# Altium schematic sheet Hierarchal-Power.SchDoc: Hierarchal Power
size 279 x 215 mm; DrawnBy: Ethan Abraham; Engineer: Ethan Abraham; SheetNumber: 2; SheetTotal: 7
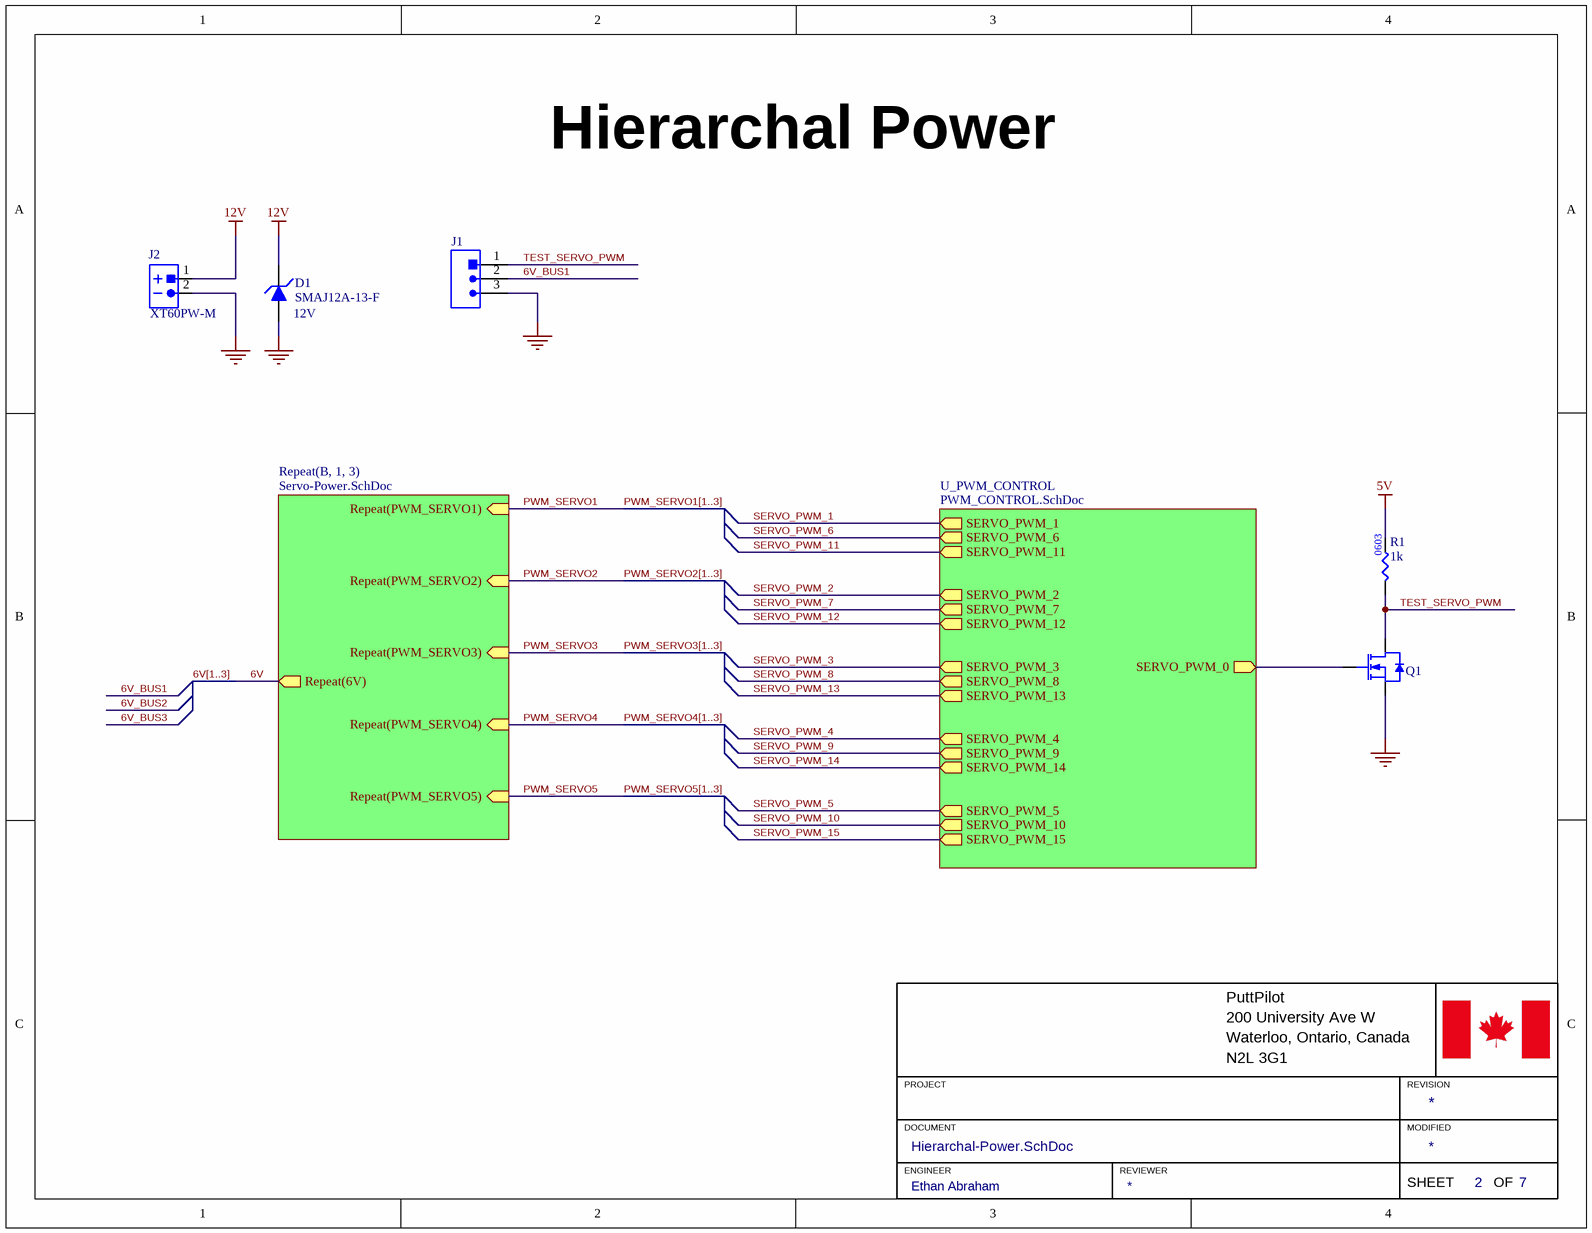
[diagram p0: Hierarchal-Power.SchDoc]

## Parts
D1  SMAJ12A-13-F  Rep Pk Reverse Voltage-Max: 12V  [SMAJ12A-13-F]
J1  TSW-101-08-G-T-RA  [HEADER_3POS_R/A_2.54MM]  (value not drawn)
J2  XT60PW-M  [XT60PW-M]
Q1  DMN6140L-7  [.SOT-23-3]  (value not drawn)
R1  Resistance: 1k  [.RES_0603]  (hidden comment: RC0603FR-071KL)

## Sub-sheets
Repeat(B, 1, 3) = Servo-Power.SchDoc: Repeat(PWM_SERVO1) (in), Repeat(PWM_SERVO2) (in), Repeat(PWM_SERVO3) (in), Repeat(PWM_SERVO4) (in), Repeat(PWM_SERVO5) (in), Repeat(6V) (out)
U_PWM_CONTROL = PWM_CONTROL.SchDoc: SERVO_PWM_0 (out), SERVO_PWM_1 (out), SERVO_PWM_2 (out), SERVO_PWM_3 (out), SERVO_PWM_4 (out), SERVO_PWM_5 (out), SERVO_PWM_6 (out), SERVO_PWM_7 (out), SERVO_PWM_8 (out), SERVO_PWM_9 (out), SERVO_PWM_10 (out), SERVO_PWM_11 (out), SERVO_PWM_12 (out), SERVO_PWM_13 (out), SERVO_PWM_14 (out), SERVO_PWM_15 (out)

## Nets
5V: R1.2
12V: D1.2(Pin_2) J2.1
GND: D1.1(Pin_1) J1.3 J2.2 Q1.2(Source)
6V: sheet Repeat(B, 1, 3)/Repeat(6V)
6V_BUS1: J1.2
PWM_SERVO1: sheet Repeat(B, 1, 3)/Repeat(PWM_SERVO1)  [also labelled PWM_SERVO1[1..3]]
PWM_SERVO2: sheet Repeat(B, 1, 3)/Repeat(PWM_SERVO2)  [also labelled PWM_SERVO2[1..3]]
PWM_SERVO3: sheet Repeat(B, 1, 3)/Repeat(PWM_SERVO3)  [also labelled PWM_SERVO3[1..3]]
PWM_SERVO4: sheet Repeat(B, 1, 3)/Repeat(PWM_SERVO4)  [also labelled PWM_SERVO4[1..3]]
PWM_SERVO5: sheet Repeat(B, 1, 3)/Repeat(PWM_SERVO5)  [also labelled PWM_SERVO5[1..3]]
SERVO_PWM_1: sheet U_PWM_CONTROL/SERVO_PWM_1
SERVO_PWM_2: sheet U_PWM_CONTROL/SERVO_PWM_2
SERVO_PWM_3: sheet U_PWM_CONTROL/SERVO_PWM_3
SERVO_PWM_4: sheet U_PWM_CONTROL/SERVO_PWM_4
SERVO_PWM_5: sheet U_PWM_CONTROL/SERVO_PWM_5
SERVO_PWM_6: sheet U_PWM_CONTROL/SERVO_PWM_6
SERVO_PWM_7: sheet U_PWM_CONTROL/SERVO_PWM_7
SERVO_PWM_8: sheet U_PWM_CONTROL/SERVO_PWM_8
SERVO_PWM_9: sheet U_PWM_CONTROL/SERVO_PWM_9
SERVO_PWM_10: sheet U_PWM_CONTROL/SERVO_PWM_10
SERVO_PWM_11: sheet U_PWM_CONTROL/SERVO_PWM_11
SERVO_PWM_12: sheet U_PWM_CONTROL/SERVO_PWM_12
SERVO_PWM_13: sheet U_PWM_CONTROL/SERVO_PWM_13
SERVO_PWM_14: sheet U_PWM_CONTROL/SERVO_PWM_14
SERVO_PWM_15: sheet U_PWM_CONTROL/SERVO_PWM_15
TEST_SERVO_PWM: J1.1 Q1.3(Drain) R1.1
NetQ1_1: Q1.1(Gate) ; sheet U_PWM_CONTROL/SERVO_PWM_0

## Buses and harness runs
bus 6V[1..3]

## Notes on the sheet
- PuttPilot
- 200 University Ave W
- PROJECT
- Waterloo, Ontario, Canada
- N2L 3G1
- REVISION
- DOCUMENT
- ENGINEER
- REVIEWER
- MODIFIED
- SHEET
- OF

## Library data of the parts
D1 = SMAJ12A-13-F: TVS DIODE 12VWM; Manufacturer: Diodes; Package Body Material: Plastic; Diode Element Material: SILICON; Diode Type: TRANS VOLTAGE SUPPRESSOR; Number of Elements: 1; Time @ Peak Reflow Temperature-Max (s): 40s; Polarity: Unidirectional; Additional Feature: EXCELLENT CLAMPING CAPABILITY; Max Breakdown Voltage: 14.7V; Min Breakdown Voltage: 13.3V; Breakdown Voltage-Nom: 14V; Clamping Voltage-Max: 19.9V; Non-rep Peak Rev Power Dis-Max: 400W; Max Power Dissipation: 1W; Qualification Status: Not Qualified; Supplier 1: Digikey; Manufacturer Part Number: SMAJ12A-13-F; RoHS: Yes; Category: TVS Diodes; Stock 1: 25706; Pricing 1: 1=0.29, 10=0.197, 100=0.1322, 500=0.1019, 1000=0.09178, 2000=0.08313 (USD); Number of Pins: 2; Package Shape: Rectangular; Terminal Finish: Tin; Min Operating Temperature: -55°C; Max Operating Temperature: 150°C; JESD-609 Code: e3; JESD-30 Code: R-PDSO-C2; Package Style: SMALL OUTLINEMeter; Surface Mount: Yes; Terminal Form: C BEND; Terminal Position: DUAL; Moisture Sensitivity Level: 1; Peak Reflow Temperature (Cel): 260°C; Technology: AVALANCHE; RoHS Compliant: Yes; Reach SVHC Compliant: No; ComponentLink1URL: https://datasheet.ciiva.com:443/pdfs/VipMasterIC/IC/DIOD/DIOD-S-A0009689838/DIOD-S-A0009691421-1.pdf?src-supplier=IHS+Markit; ComponentLink1Description: https://datasheet.ciiva.com:443/pdfs/VipMasterIC/IC/DIOD/DIOD-S-A0009689838/DIOD-S-A0009691421-1.pdf?src-supplier=IHS+Markit; ComponentLink2URL: https://datasheet.ciiva.com/15143/getdatasheetpartid-164236-15143864.pdf?src-supplier=Verical; ComponentLink2Description: https://datasheet.ciiva.com/15143/getdatasheetpartid-164236-15143864.pdf?src-supplier=Verical; Supplier Part Number 1: SMAJ12A-FDICT-ND
J1 = TSW-101-08-G-T-RA: CONN HEADER R/A 3POS 2.54MM
J2 = XT60PW-M: XT60PW Male; Manufacturer: Unclassified; Manufacturer Part Number: XT60PW-M; Supplier Part Number 1: 1805375
Q1 = DMN6140L-7: MOSFET N-CH 60V 1.6A SOT-23; Manufacturer: Diodes; Rds On Max: 140mR; Input Capacitance: 315pF; Max Power Dissipation: 700mW; Threshold Voltage: 3V; Number of Channels: 1; Gate to Source Voltage (Vgs): 20V; Fall Time: 2.7ns; Rise Time: 3.6ns; Turn-Off Delay Time: 16.3ns; Turn-On Delay Time: 2.6ns; Polarity: N-CHANNEL; Supplier 1: Future Electronics; Manufacturer Part Number: DMN6140L-7; RoHS: Yes; Category: MOSFETs; Stock 1: 624000; Pricing 1: 3000=0.0489, 9000=0.047, 15000=0.0462, 45000=0.0445, 75000=0.043 (USD); Mount: Surface Mount; Case/Package: SOT-23; Number of Pins: 3; Weight: 0.000282oz; Min Operating Temperature: -55°C; Max Operating Temperature: 150°C; Package Quantity: 1; Packaging: Tape and Reel; Drain to Source Voltage (Vdss): 60V; Continuous Drain Current (ID): 1.6A; Drain to Source Resistance: 140mR; Series: -; Reach SVHC Compliant: No; Lead Free: Lead Free; RoHS Compliant: Yes; ComponentLink1URL: https://datasheet.ciiva.com/29747/dmn6140l-29747654.pdf?src-supplier=Digikey; ComponentLink1Description: https://datasheet.ciiva.com/29747/dmn6140l-29747654.pdf?src-supplier=Digikey; ComponentLink2URL: https://datasheet.ciiva.com/29747/dmn6140l-29747660.pdf?src-supplier=Digikey; ComponentLink2Description: https://datasheet.ciiva.com/29747/dmn6140l-29747660.pdf?src-supplier=Digikey; Supplier Part Number 1: 4046633
R1 = RC0603FR-071KL: RES 1K OHM 0603; Manufacturer: Yageo; Tolerance: 1%; Additional Feature: LASER TRIMMABLE; Rated Power Dissipation (P): 100mW; Rated Temperature: 70°C; Temperature Coefficient: 100ppm/°C; Working Voltage: 75V; Package Height: 0.45mm; Package Length: 1.6mm; Package Width: 0.8mm; Supplier 1: Future Electronics; Manufacturer Part Number: RC0603FR-071KL; RoHS: Yes; Category: Chip SMD Resistors; Stock 1: 12810000; Pricing 1: 5000=0.0026, 50000=0.0025, 150000=0.0024, 375000=0.0023, 1000000=0.0022 (USD); Mount: Surface Mount; Number of Pins: 2; Package Shape: Rectangular; Size Code: 0603; Terminal Finish: Nickel; Min Operating Temperature: -55°C; Max Operating Temperature: 155°C; JESD-609 Code: e3; Resistor Type: FIXED RESISTOR; Construction: Chip; Package Style: SMTMeter; Packaging: Tape and Reel; Technology: METAL GLAZE/THICK FILM; Termination: Wraparound; Reach SVHC Compliant: Yes; RoHS Compliant: Yes; ComponentLink1URL: https://datasheet.ciiva.com:443/pdfs/VipMasterIC/IC/YAGO/YAGO-S-A0008145938/YAGO-S-A0008145938-1.pdf?src-supplier=IHS+Markit; ComponentLink1Description: https://datasheet.ciiva.com:443/pdfs/VipMasterIC/IC/YAGO/YAGO-S-A0008145938/YAGO-S-A0008145938-1.pdf?src-supplier=IHS+Markit; ComponentLink2URL: https://datasheet.ciiva.com/11808/0900766b80f96399-11808081.pdf?src-supplier=Rs; ComponentLink2Description: https://datasheet.ciiva.com/11808/0900766b80f96399-11808081.pdf?src-supplier=Rs; ComponentLink3URL: https://datasheet.ciiva.com/8896/pyu-rc0603-51-rohs-l-4-8896106.pdf?src-supplier=Avnet; ComponentLink3Description: https://datasheet.ciiva.com/8896/pyu-rc0603-51-rohs-l-4-8896106.pdf?src-supplier=Avnet; ComponentLink4URL: https://datasheet.ciiva.com/7660/1868787-7660790.pdf?src-supplier=Element14; ComponentLink4Description: https://datasheet.ciiva.com/7660/1868787-7660790.pdf?src-supplier=Element14; ComponentLink5URL: https://datasheet.ciiva.com/7746/1738695-7746279.pdf?src-supplier=Element14; ComponentLink5Description: https://datasheet.ciiva.com/7746/1738695-7746279.pdf?src-supplier=Element14; ComponentLink6URL: https://datasheet.ciiva.com/7746/1686128-7746280.pdf?src-supplier=Element14; ComponentLink6Description: https://datasheet.ciiva.com/7746/1686128-7746280.pdf?src-supplier=Element14; ComponentLink7URL: https://datasheet.ciiva.com/7746/1738695-7746281.pdf?src-supplier=Element14; ComponentLink7Description: https://datasheet.ciiva.com/7746/1738695-7746281.pdf?src-supplier=Element14; ComponentLink8URL: https://datasheet.ciiva.com/7983/443971-7983613.pdf?src-supplier=Element14; ComponentLink8Description: https://datasheet.ciiva.com/7983/443971-7983613.pdf?src-supplier=Element14; ComponentLink9URL: https://datasheet.ciiva.com/15189/getdatasheetpartid-404327-15189644.pdf?src-supplier=Verical; ComponentLink9Description: https://datasheet.ciiva.com/15189/getdatasheetpartid-404327-15189644.pdf?src-supplier=Verical; Supplier Part Number 1: 4016291